# EAGLE design AUX power board (V4.0) (EAGLE 8.4.1)
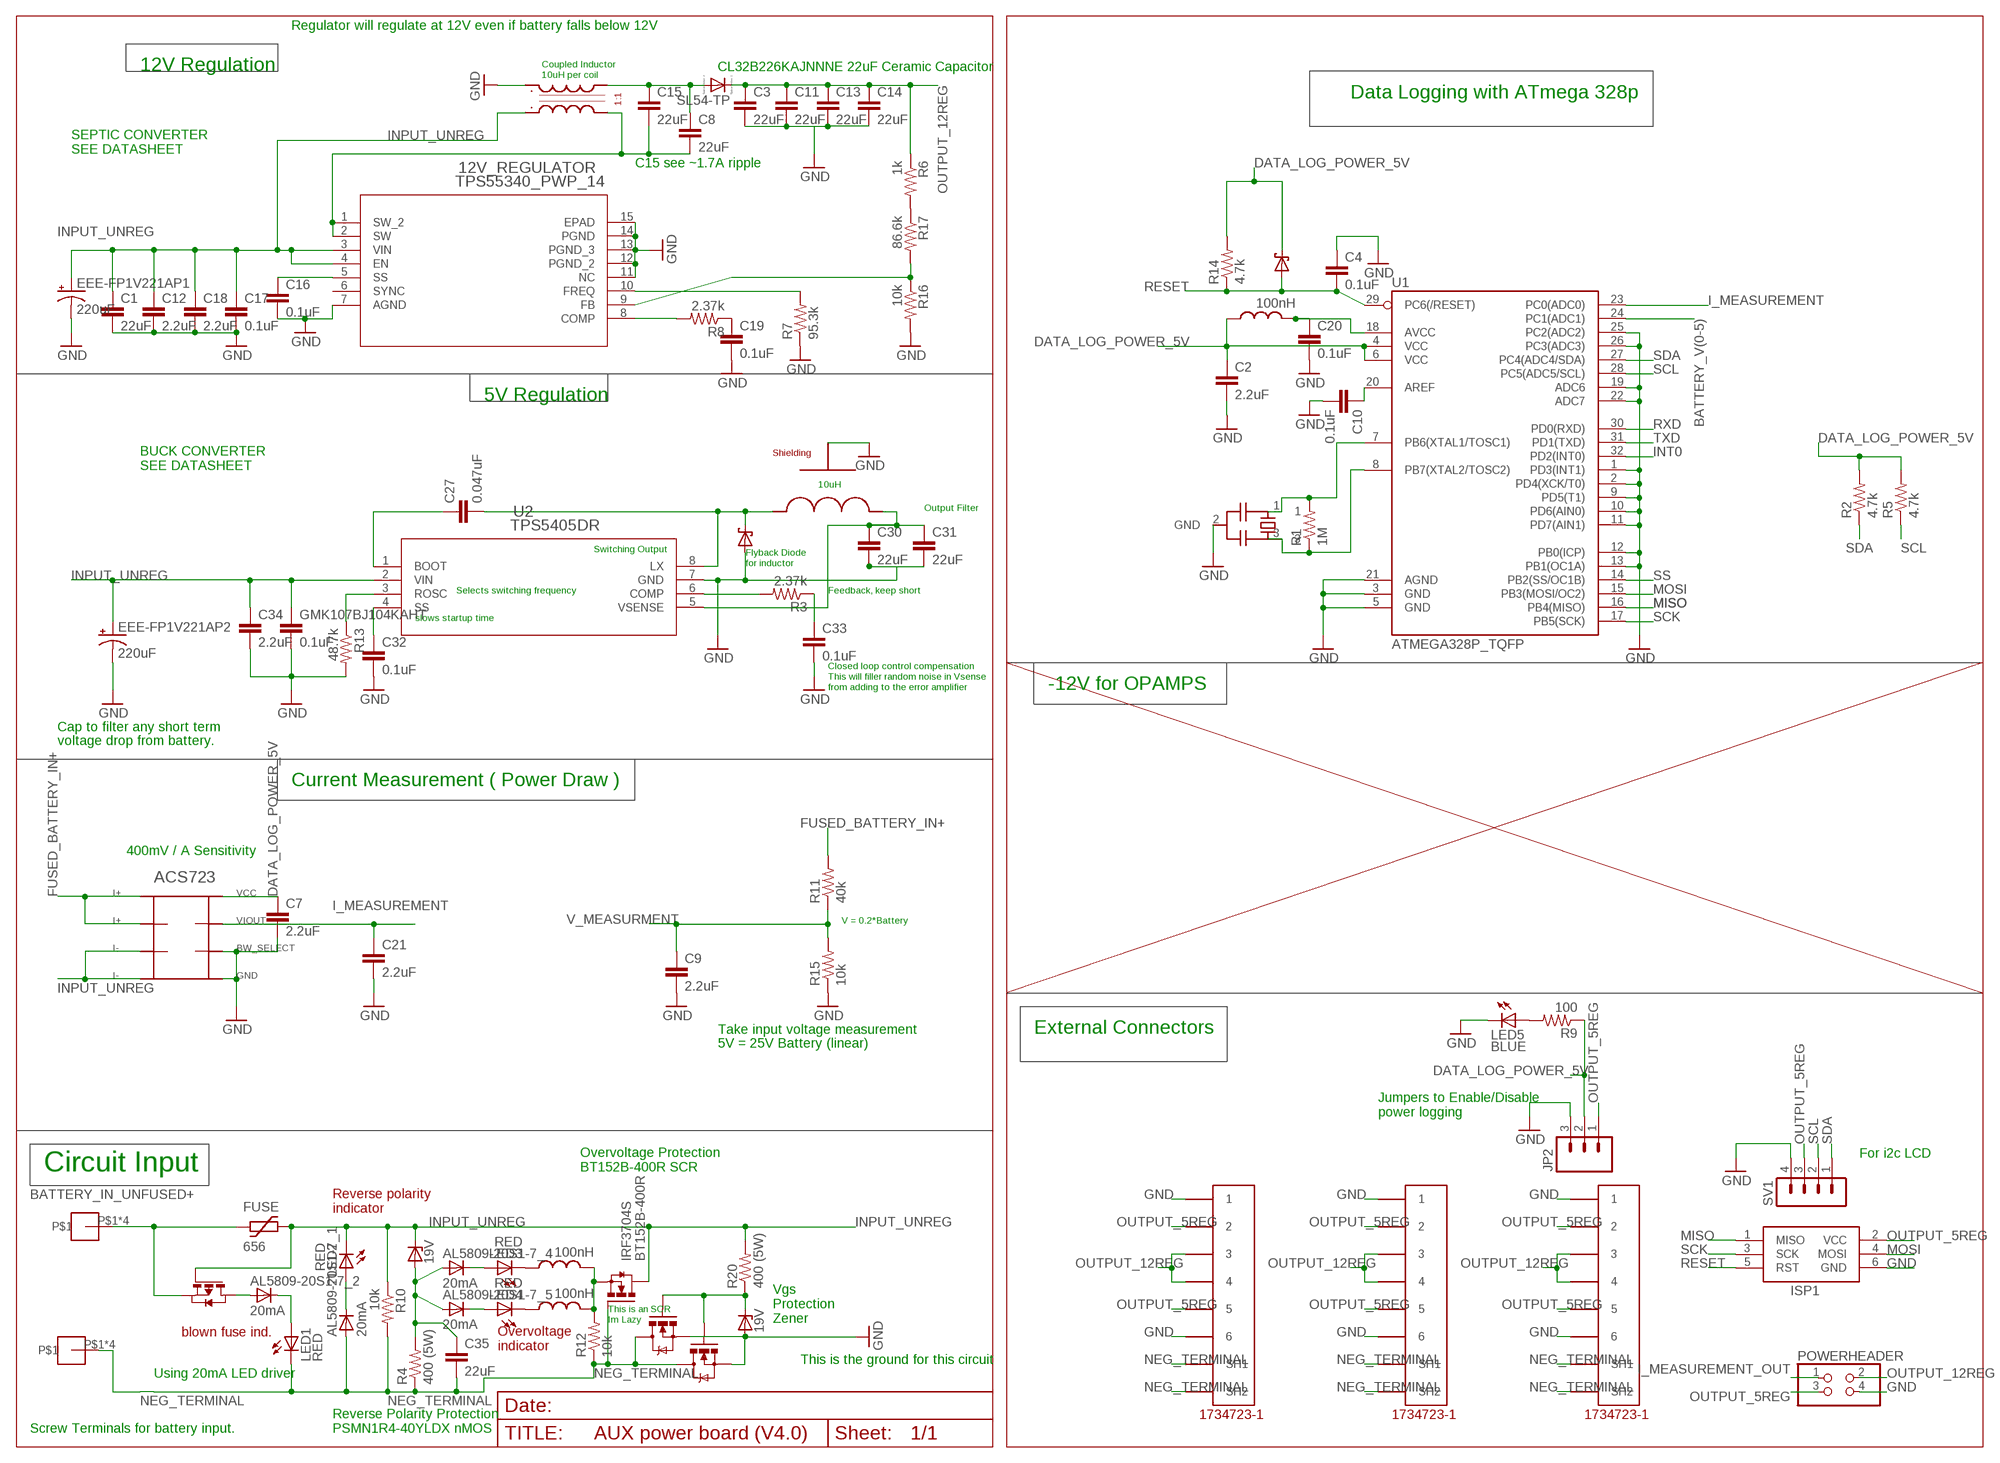
[diagram p0: schematic, sheet 1]

## Parts
1N5354BRLG  19V  ZENER-DIODEDO41Z10  [DO41Z10]
1N5356BRLG_1  19V  ZENER-DIODEDO41Z10  [DO41Z10]
12V_REGULATOR  TPS55340_PWP_14  [PWP14]
16MHZ  CSTCE16M0V53-R0  [RESONATOR]
AL5809-20S1-7_1  20mA  D-SOD123  [SOD123]
AL5809-20S1-7_2  20mA  D-SOD123  [SOD123]
AL5809-20S1-7_4  20mA  D-SOD123  [SOD123]
AL5809-20S1-7_5  20mA  D-SOD123  [SOD123]
BT152B-400R  IRF3704S  [D2PACK]
C1  22uF  C-EUC1210  [C1210]
C2  2.2uF  C-EUC0603  [C0603]
C3  22uF  C-EUC1210  [C1210]
C4  0.1uF  C-EUC0603  [C0603]
C7  2.2uF  C-EUC0603  [C0603]
C8  22uF  C-EUC1210  [C1210]
C9  2.2uF  C-EUC0603  [C0603]
C10  0.1uF  C-EUC0603  [C0603]
C11  22uF  C-EUC1210  [C1210]
C12  2.2uF  C-EUC0603  [C0603]
C13  22uF  C-EUC1210  [C1210]
C14  22uF  C-EUC1210  [C1210]
C15  22uF  C-EUC1210  [C1210]
C16  0.1uF  C-EUC0603  [C0603]
C17  0.1uF  C-EUC0603  [C0603]
C18  2.2uF  C-EUC0603  [C0603]
C19  0.1uF  C-EUC0603  [C0603]
C20  0.1uF  C-EUC0603  [C0603]
C21  2.2uF  C-EUC0603  [C0603]
C27  0.047uF  C-EUC0603  [C0603]
C30  22uF  C-EUC1210  [C1210]
C31  22uF  C-EUC1210  [C1210]
C32  0.1uF  C-EUC0603  [C0603]
C33  0.1uF  C-EUC0603  [C0603]
C34  2.2uF  C-EUC0603  [C0603]
C35  22uF  C-EUC1210  [C1210]
EEE-FP1V221AP1  220uF  CPOL-US175TMP-0808  [175TMP-0808]
EEE-FP1V221AP2  220uF  CPOL-US175TMP-0808  [175TMP-0808]
FUSE  656  [656]
GMK107BJ104KAHT  0.1uF  C-EUC0603  [C0603]
ISP1  AVRISP-6  [AVRISP]
JP2  M03PTH  [1X03]
LED1  RED  LEDSML1206  [SML1206]
LED2  RED  LEDSML1206  [SML1206]
LED3  RED  LEDSML1206  [SML1206]
LED4  RED  LEDSML1206  [SML1206]
LED5  BLUE  LEDSML1206  [SML1206]
MLZ2012DR10DT000  100nH  L-USL2012C  [L2012C]
MLZ2012DR10DT001  100nH  L-USL2012C  [L2012C]
MLZ2012DR10DT002  100nH  L-USL2012C  [L2012C]
MURS120T3G  MBRS130LT3  [SMB]
MURS120T3G1  MBRS130LT3  [SMB]
POWERHEADER  PINHD-2X2  [2X02]
PSMN1R4-40YLDX1  MOSFET-NCHANNELFDS6630A  [POWERSO08]
PSMN1R4-40YLDX2  MOSFET-NCHANNELFDS6630A  [POWERSO08]
R1  1M  R-US_R0603  [R0603]
R2  4.7k  R-US_R0805  [R0805]
R3  2.37k  R-US_R0603  [R0603]
R4  400 (5W)  R-US_0817/22  [P0817/22]
R5  4.7k  R-US_R0805  [R0805]
R6  1k  R-US_R0805  [R0805]
R7  95.3k  R-US_R0603  [R0603]
R8  2.37k  R-US_R0603  [R0603]
R9  100  R-US_R0805  [R0805]
R10  10k  R-US_R0805  [R0805]
R11  40k  R-US_R0805  [R0805]
R12  10k  R-US_R0805  [R0805]
R13  48.7k  R-US_R0805  [R0805]
R14  4.7k  R-US_R0805  [R0805]
R15  10k  R-US_R0805  [R0805]
R16  10k  R-US_R0805  [R0805]
R17  86.6k  R-US_R0805  [R0805]
R20  400 (5W)  R-US_0817/22  [P0817/22]
SL54-TP  DIODE_E-SMC  [DIODE_SMC]
SV1  MA04-1  [MA04-1]
U1  ATMEGA328P_TQFP  [TQFP32-08]
U2  TPS5405DR  [D8]
U$1  ACS723  [SO08]
U$3  5555140-6  [1734723-1_RJ11]
U$4  5555140-6  [1734723-1_RJ11]
U$5  CDEP147NP-100MC-125  [NONSTANDARD]
U$6  SCREW-8191  [SCREW-8191]
U$7  SCREW-8191  [SCREW-8191]
U$9  744873100  [1592]
U$10  5555140-6  [1734723-1_RJ11]
ZVP4525E6TA_1  MOSFET-PCHANNELFDS6675  PMOSSOT23-6  [SOT23-6]

## Nets
BATTERY_IN_UNFUSED+: FUSE.P$1 U$6.P$1 U$6.P$2 U$6.P$3 U$6.P$4 ZVP4525E6TA_1.4(S)
BATTERY_V(0-5): U1.24(PC1(ADC1))
DATA_LOG_POWER_5V: C2.1 C7.1 JP2.2 MLZ2012DR10DT000.1 MURS120T3G1.C R2.2 R5.2 R9.1 R14.2 U1.4(VCC) U1.6(VCC) U$1.8
FUSED_BATTERY_IN+: R11.2 U$1.1 U$1.2
GND: 1N5356BRLG_1.A 12V_REGULATOR.7(AGND) 12V_REGULATOR.11(NC) 12V_REGULATOR.12(PGND_2) 12V_REGULATOR.13(PGND_3) 12V_REGULATOR.14(PGND) 12V_REGULATOR.15(EPAD) 16MHZ.2(GND) C1.2 C2.2 C3.2 C4.1 C7.2 C9.2 C10.2 C11.2 C12.2 C13.2 C14.2 C16.2 C17.2 C18.2 C19.2 C20.2 C21.2 C30.2 C31.2 C32.2 C33.2 C34.2 EEE-FP1V221AP1.- EEE-FP1V221AP2.- GMK107BJ104KAHT.2 ISP1.6(GND) JP2.3 LED5.C MURS120T3G.A POWERHEADER.4 PSMN1R4-40YLDX1.SOURCE1(S) PSMN1R4-40YLDX1.SOURCE2(S) PSMN1R4-40YLDX1.SOURCE(S) PSMN1R4-40YLDX2.SOURCE1(S) PSMN1R4-40YLDX2.SOURCE2(S) PSMN1R4-40YLDX2.SOURCE(S) R7.1 R13.2 R15.1 R16.2 SV1.4 U1.1(PD3(INT1)) U1.2(PD4(XCK/T0)) U1.3(GND) U1.5(GND) U1.9(PD5(T1)) U1.10(PD6(AIN0)) U1.11(PD7(AIN1)) U1.12(PB0(ICP)) U1.13(PB1(OC1A)) U1.19(ADC6) U1.21(AGND) U1.22(ADC7) U1.25(PC2(ADC2)) U1.26(PC3(ADC3)) U2.7(GND) U$1.5 U$1.6 U$3.6 U$4.6 U$5.GND U$9.L1_P1(L1_A) U$10.6
I_MEASUREMENT: C21.1 U1.23(PC0(ADC0)) U$1.7
I_MEASUREMENT_OUT: POWERHEADER.1
INPUT_UNREG: 1N5354BRLG.C 12V_REGULATOR.3(VIN) 12V_REGULATOR.4(EN) BT152B-400R.2(D) C1.1 C12.1 C17.1 C18.1 C34.1 EEE-FP1V221AP1.+ EEE-FP1V221AP2.+ FUSE.P$2 GMK107BJ104KAHT.1 LED2.C R10.1 R20.2 U2.2(VIN) U$1.3 U$1.4 U$9.L2_P2(L2_A) ZVP4525E6TA_1.3(G)
INT0: U1.32(PD2(INT0))
MISO: ISP1.1(MISO) U1.16(PB4(MISO))
MOSI: ISP1.4(MOSI) U1.15(PB3(MOSI/OC2))
N$1: C27.1 U2.1(BOOT)
N$3: R6.2 R17.1
N$4: 12V_REGULATOR.1(SW_2) 12V_REGULATOR.2(SW) C8.2 C15.2 U$9.L2_P3(L2_B)
N$5: C20.1 MLZ2012DR10DT000.2 U1.18(AVCC)
N$6: C8.1 C15.1 SL54-TP.A(C) U$9.L1_P4(L1_B)
N$7: C27.2 MURS120T3G.C U2.8(LX) U$5.PAD1(PIN1)
N$8: 12V_REGULATOR.5(SS) C16.1
N$9: 12V_REGULATOR.8(COMP) R8.2
N$10: 12V_REGULATOR.10(FREQ) R7.2
N$13: C19.1 R8.1
N$14: C10.1 U1.20(AREF)
N$15: 12V_REGULATOR.9(FB) R16.1 R17.2
N$17: AL5809-20S1-7_2.2(A) ZVP4525E6TA_1.1(D) ZVP4525E6TA_1.2(D) ZVP4525E6TA_1.5(D) ZVP4525E6TA_1.6(D)
N$18: 16MHZ.1 R1.2 U1.7(PB6(XTAL1/TOSC1))
N$19: 1N5356BRLG_1.C PSMN1R4-40YLDX1.GATE(G) PSMN1R4-40YLDX2.GATE(G) R20.1
N$20: R13.1 U2.3(ROSC)
N$21: C32.1 U2.4(SS)
N$22: AL5809-20S1-7_1.1(C) LED2.A
N$23: C33.1 R3.1
N$24: R3.2 U2.6(COMP)
N$25: AL5809-20S1-7_2.1(C) LED1.A
N$26: C30.1 C31.1 U2.5(VSENSE) U$5.PAD2(PIN2)
N$27: 16MHZ.3 R1.1 U1.8(PB7(XTAL2/TOSC2))
N$28: AL5809-20S1-7_4.1(C) LED3.A
N$29: 1N5354BRLG.A AL5809-20S1-7_4.2(A) AL5809-20S1-7_5.2(A) C35.1 R4.2
N$30: LED3.C MLZ2012DR10DT001.1
N$31: AL5809-20S1-7_5.1(C) LED4.A
N$32: LED4.C MLZ2012DR10DT002.1
N$33: BT152B-400R.3(S) MLZ2012DR10DT001.2 MLZ2012DR10DT002.2 R12.2
N$34: LED5.A R9.2
NEG_TERMINAL: AL5809-20S1-7_1.2(A) BT152B-400R.1(G) C35.2 LED1.C PSMN1R4-40YLDX1.DRAIN1(D) PSMN1R4-40YLDX1.DRAIN(D) PSMN1R4-40YLDX2.DRAIN1(D) PSMN1R4-40YLDX2.DRAIN(D) R4.1 R10.2 R12.1 U$3.SH1 U$3.SH2 U$4.SH1 U$4.SH2 U$7.P$1 U$7.P$2 U$7.P$3 U$7.P$4 U$10.SH1 U$10.SH2
OUTPUT_5REG: ISP1.2(VCC) JP2.1 POWERHEADER.3 SV1.3 U$3.2 U$3.5 U$4.2 U$4.5 U$10.2 U$10.5
OUTPUT_12REG: C3.1 C11.1 C13.1 C14.1 POWERHEADER.2 R6.1 SL54-TP.C(A) U$3.3 U$3.4 U$4.3 U$4.4 U$10.3 U$10.4
RESET: C4.2 ISP1.5(RST) MURS120T3G1.A R14.1 U1.29(PC6(/RESET))
RXD: U1.30(PD0(RXD))
SCK: ISP1.3(SCK) U1.17(PB5(SCK))
SCL: R5.1 SV1.2 U1.28(PC5(ADC5/SCL))
SDA: R2.1 SV1.1 U1.27(PC4(ADC4/SDA))
SS: U1.14(PB2(SS/OC1B))
TXD: U1.31(PD1(TXD))
V_MEASURMENT: C9.1 R11.1 R15.2
Unconnected: 12V_REGULATOR.6(SYNC) U$3.1 U$4.1 U$10.1

## Notes on the sheet
- Regulator will regulate at 12V even if battery falls below 12V
- 12V Regulation | CL32B226KAJNNNE 22uF Ceramic Capacitor
- Coupled Inductor
  10uH per coil
- Data Logging with ATmega 328p
- SEPTIC CONVERTER
  SEE DATASHEET
- C15 see ~1.7A ripple
- 5V Regulation
- BUCK CONVERTER
  SEE DATASHEET
- 10uH
- Output Filter
- Switching Output
- Flyback Diode
  for inductor
- Selects switching frequency | Feedback, keep short
- slows startup time
- Closed loop control compensation
  This will filler random noise in Vsense
  from adding to the error amplifier
- -12V for OPAMPS
- Cap to filter any short term
- voltage drop from battery.
- Current Measurement ( Power Draw )
- 400mV / A Sensitivity
- V = 0.2*Battery
- Take input voltage measurement | External Connectors
- 5V = 25V Battery (linear)
- Jumpers to Enable/Disable
  power logging
- For i2c LCD
- Circuit Input
- Overvoltage Protection
  BT152B-400R SCR
- Reverse polarity
  indicator
- This is an SCR
  Im Lazy
- Vgs 
  Protection
  Zener
- blown fuse ind.
- Overvoltage
  indicator
- This is the ground for this circuit
- Using 20mA LED driver
- Screw Terminals for battery input.
- Reverse Polarity Protection
  PSMN1R4-40YLDX nMOS

## Library data of the parts
1N5354BRLG 1N5356BRLG_1 = diode:ZENER-DIODE: Z-Diode
12V_REGULATOR = TPS55340PWP:TPS55340_PWP_14; MANUFACTURER_PART_NUMBER: tps55340_pwp_14; VENDOR: Texas Instruments
16MHZ = arduino_Uno_Rev3-02-TH:CSTCE16M0V53-R0
AL5809-20S1-7_1 AL5809-20S1-7_2 AL5809-20S1-7_4 AL5809-20S1-7_5 = semicon-smd-ipc:D-: DIODE unfilled
BT152B-400R = transistor-power:IRF3704: SMPS MOSFET HEXFET® Power MOSFET Source: http://www.irf.com/product-info/datasheets/data/irf3704.pdf
C1 C3 C4 C7-C9 C11-C21 C27 C30-C35 GMK107BJ104KAHT = rcl:C-EU: CAPACITOR, European symbol
C2 C10 = resistor:C-EU: CAPACITOR, European symbol
EEE-FP1V221AP1 EEE-FP1V221AP2 = rcl:CPOL-US: POLARIZED CAPACITOR, American symbol
FUSE = GlassFuseHolder:656
ISP1 = adafruit:AVRISP: AVR ISP HEADER Standard 6 pin header for AVR programming
JP2 = SparkFun (2015_10_14 22_27_04 UTC):M03: Header 3 Standard 3-pin 0.1" header. Use with straight break away headers (SKU : PRT-00116), right angle break away headers (PRT-00553), swiss pins (PRT-00743), machine pins (PRT-00117), and female headers (PRT-00115). Molex polarized connector foot print use with SKU : PRT-08232 with associated crimp pins and housings.
LED1-LED5 = E-P-008-R1.2:LED: LED OSRAM: - CHIPLED LG R971, LG N971, LY N971, LG Q971, LY Q971, LO R971, LY R971 LH N974, LH R974 LS Q976, LO Q976, LY Q976 LO Q996 - Hyper CHIPLED LW Q18S LB Q993, LB Q99A, LB R99A - SideLED LS A670, LO A670, LY A670, LG A670, LP A670 LB A673, LV A673, LT A673, LW A673 LH A674 LY A675 LS A676, LA A676, LO A676, LY A676, LW A676 LS A679, LY A679, LG A679 - Hyper Micro SIDELED® LS Y876, LA Y876, LO Y876, LY Y876 LT Y87S - SmartLED LW L88C, LW L88S LB L89C, LB L89S, LG L890 LS L89K, LO L89K, LY L89K LS L896, LA L896, LO L896, LY L896 - TOPLED LS T670, LO T670, LY T670, LG T670, LP T670 LSG T670, LSP T670, LSY T670, LOP T670, LYG T670 LG T671, LOG T671, LSG T671 LB T673, LV T673, LT T673, LW T673 LH T674 LS T676, LA T676, LO T676, LY T676, LB T676, LH T676, LSB T676, LW T676 LB T67C, LV T67C, LT T67C, LS T67K, LO T67K, LY T67K, LW E67C LS E67B, LA E67B, LO E67B, LY E67B, LB E67C, LV E67C, LT E67C LW T67C LS T679, LY T679, LG T679 LS T770, LO T770, LY T770, LG T770, LP T770 LB T773, LV T773, LT T773, LW T773 LH T774 LS E675, LA E675, LY E675, LS T675 LS T776, LA T776, LO T776, LY T776, LB T776 LHGB T686 LT T68C, LB T68C - Hyper Mini TOPLED® LB M676 - Mini TOPLED Santana® LG M470 LS M47K, LO M47K, LY M47K Source: http://www.osram.convergy.de LUXEON: - LUMILED® LXK2-PW12-R00, LXK2-PW12-S00, LXK2-PW14-U00, LXK2-PW14-V00 LXK2-PM12-R00, LXK2-PM12-S00, LXK2-PM14-U00 LXK2-PE12-Q00, LXK2-PE12-R00, LXK2-PE12-S00, LXK2-PE14-T00, LXK2-PE14-U00 LXK2-PB12-K00, LXK2-PB12-L00, LXK2-PB12-M00, LXK2-PB14-N00, LXK2-PB14-P00, LXK2-PB14-Q00 LXK2-PR12-L00, LXK2-PR12-M00, LXK2-PR14-Q00, LXK2-PR14-R00 LXK2-PD12-Q00, LXK2-PD12-R00, LXK2-PD12-S00 LXK2-PH12-R00, LXK2-PH12-S00 LXK2-PL12-P00, LXK2-PL12-Q00, LXK2-PL12-R00 Source: www.luxeon.com KINGBRIGHT: KA-3528ASYC Source: www.kingbright.com
MLZ2012DR10DT000 MLZ2012DR10DT001 MLZ2012DR10DT002 = resistor:L-US: INDUCTOR, American symbol
MURS120T3G MURS120T3G1 = diode:MBRS130LT3: Schottky Power Rectifier Source: http://www.onsemi.com/pub/Collateral/MBRS130LT3-D.PDF
POWERHEADER = pinhead:PINHD-2X2: PIN HEADER
PSMN1R4-40YLDX1 PSMN1R4-40YLDX2 = PSMN1R4-40YLDX:MOSFET-NCHANNEL: Common NMOSFET Parts MFG P/N Store ID Prod ID FDD8780 TRANS-09984 SI7820DN TRANS-11055 FDS6630A IC-08089 2N7002PW TRANS-11151 FQP30N06L COM-10213 TRANS-10060 BSS123LT1G TRANS-08345 BSS138 TRANS-00830 BS170 2N7000; PROD_ID: IC-08089
R1 R2 R5 R9-R12 R14 R15 = rcl:R-US_: RESISTOR, American symbol
R3 R6-R8 R13 R16 R17 = resistor:R-US_: RESISTOR, American symbol
R4 R20 = resistor@1:R-US_: RESISTOR, American symbol
SL54-TP = eagle-ltspice:DIODE_E-: Schottky Diode; SPICEMODEL: diode; SPICEPREFIX: D
SV1 = con-lstb:MA04-1: PIN HEADER; OC_FARNELL: unknown; OC_NEWARK: unknown
U1 = SparkFun-DigitalIC:ATMEGA328P_TQFP; PROD_ID: IC-09069
U2 = TPS5405DR:TPS5405DR; MANUFACTURER_PART_NUMBER: tps5405dr; VENDOR: TEXAS INSTRUMENTS
U$1 = linear:ACS723
U$3 U$4 U$10 = 5555140-6 RJ11:5555140-6
U$5 = CDEP147NP-100MC-125:CDEP147NP-100MC-125
U$6 U$7 = Shell2013:SCREW-8191
U$9 = 744873100:744873100
ZVP4525E6TA_1 = zetex:PMOSSOT23-6: P-CHANNEL ENHANCEMENT MODE MOSFET Source: Data sheet <http://www.diodes.com/zetex/_pdfs/3.0/pdf/ZXMP10A17E6.pdf> ZXMP10A17E6; OC_FARNELL: unknown; OC_NEWARK: unknown

## Board
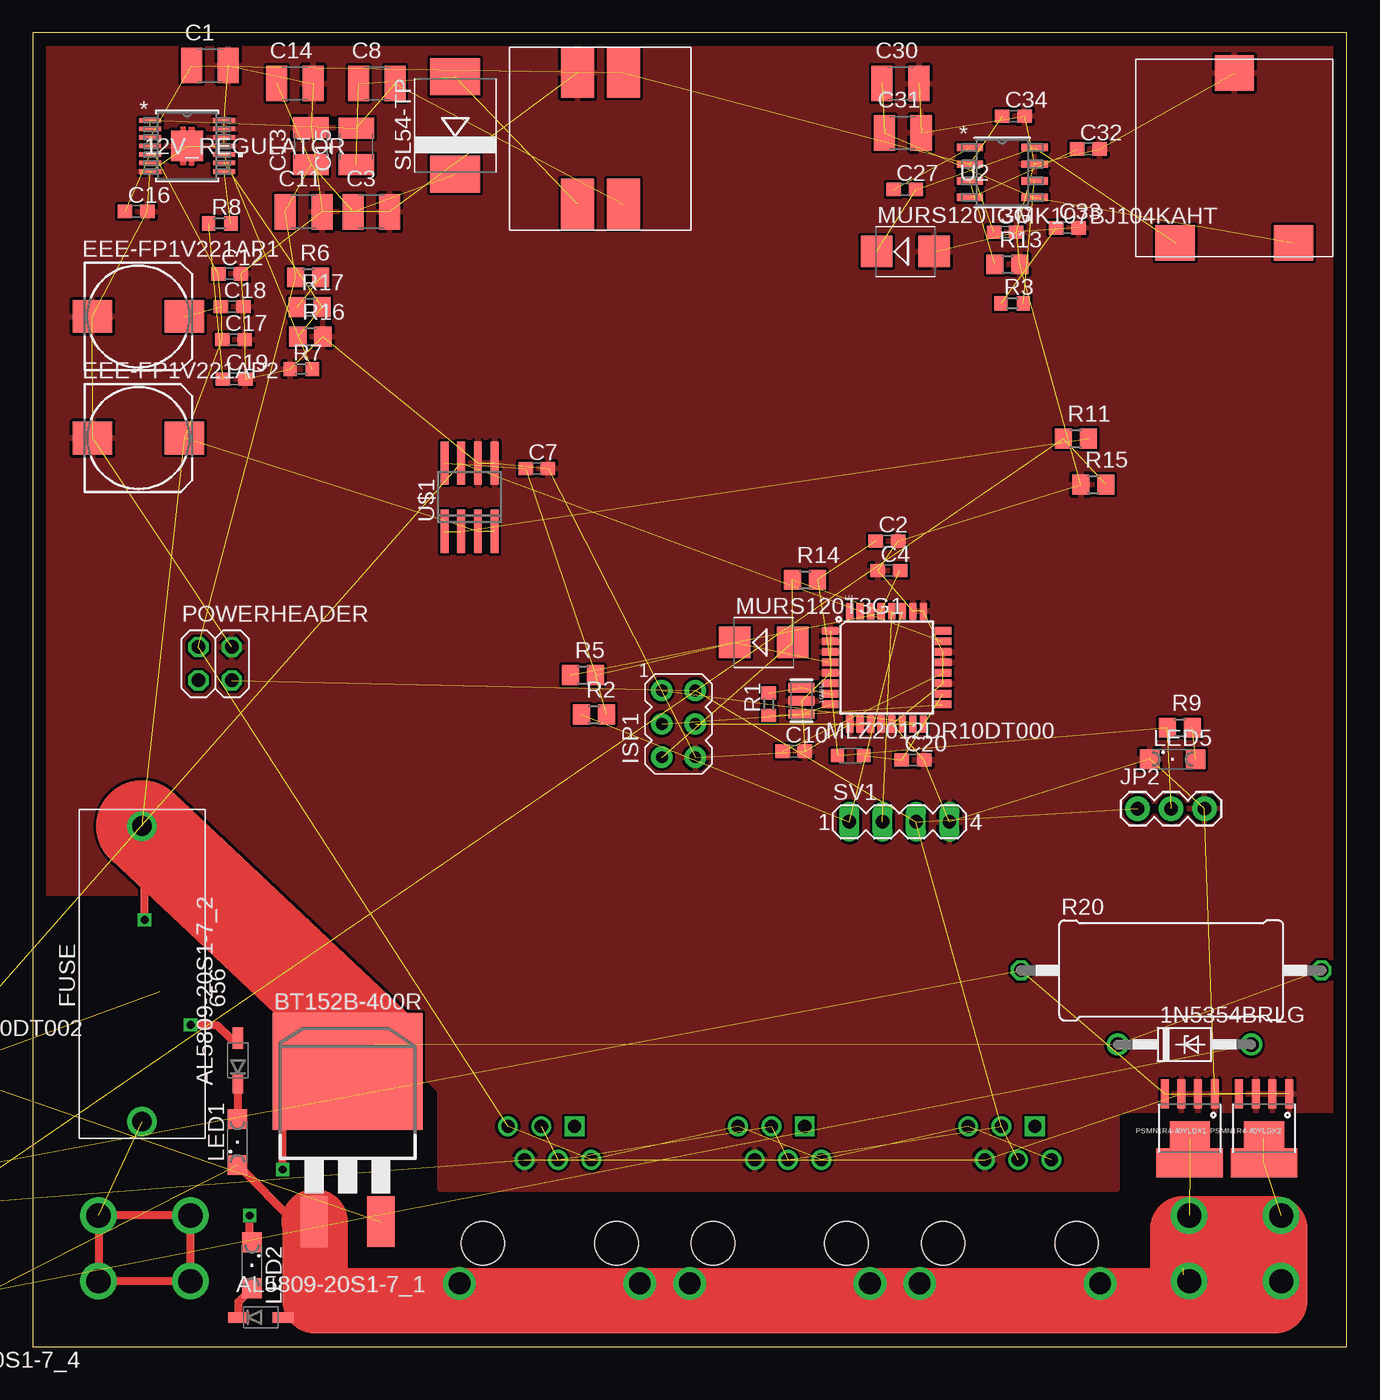
[diagram p1: board, top side]
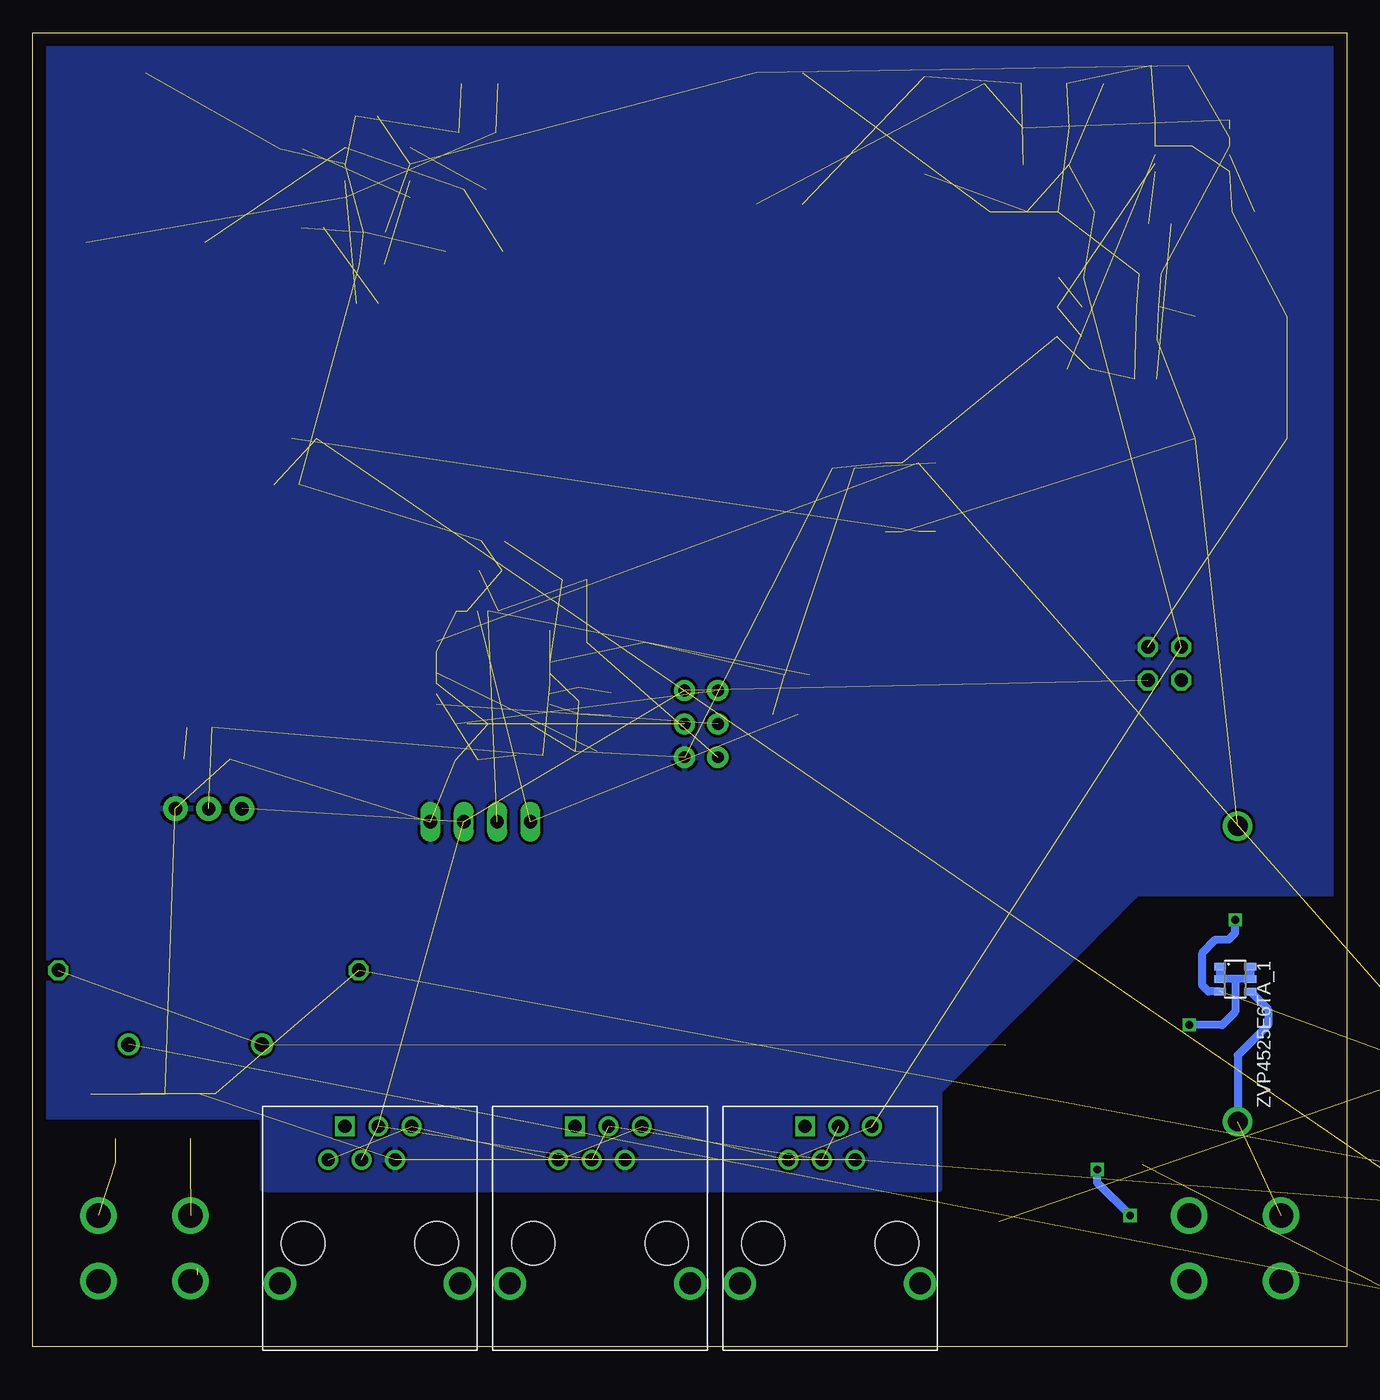
[diagram p2: board, bottom side, seen from below]

Size 100 x 100 mm. Coordinates in mm from the lower left corner, seen from the top.
Outline: 0,0 100,0 100,100 0,100 0,0
Copper layers (1*16): Top 0.035mm / dielectric 1.5mm / Bottom 0.035mm
Design rules "default": minimum track width 10mil, minimum drill 24mil, track to track 8mil, track to pad 8mil, pad to pad 8mil, via to via 8mil, smd to smd 8mil, copper to edge 40mil, drill to drill 8mil, minimum pad ring 10mil, minimum via ring 8mil, stop-mask expansion 4mil, vias tented up to drill 0mil, thermal gap 10mil

### Footprints (pad centres in the part's own frame; a part is rotated, then mirrored left to right if it is on the bottom)
DO41Z10 = drill 1.118: A 5.08,0; C -5.08,0
PWP14 = smd 1.676 x 0.356: 1 -2.819,1.95; 2 -2.819,1.3; 3 -2.819,0.65; 4 -2.819,0; 5 -2.819,-0.65; 6 -2.819,-1.3; 7 -2.819,-1.95; 8 2.819,-1.95; 9 2.819,-1.3; 10 2.819,-0.65; 11 2.819,0; 12 2.819,0.65; 13 2.819,1.3; 14 2.819,1.95 | smd 2.46 x 2.31: 15 0,0
RESONATOR = smd 0.7 x 2: 1 -1,0; 2 0,0; 3 1,0
SOD123 = smd 1.6 x 0.8: 1 -1.7,0; 2 1.7,0
D2PACK = smd 2.083 x 3.81: 1 -2.54,-8.89; 3 2.54,-8.89 | smd 11.43 x 8.89: 2 0,2.54
C1210 = smd 1.6 x 2.7: 1 -1.4,0; 2 1.4,0
C0603 = smd 1.1 x 1: 1 -0.85,0; 2 0.85,0
175TMP-0808 = smd 3 x 2.5: + 3.5,0; - -3.5,0
656 = drill 1.5: P$1 -11.25,0; P$2 11.25,0
AVRISP = drill 0.9 pad 1.626: 1 -1.27,2.54; 2 1.27,2.54; 3 -1.27,0; 4 1.27,0; 5 -1.27,-2.54; 6 1.27,-2.54
1X03 = drill 1.016 pad 1.88: 1 0,0; 2 2.54,0; 3 5.08,0
SML1206 = smd 1.5 x 1.5: A 1.75,0; C -1.75,0
L2012C = smd 1 x 1: 1 -1,0; 2 1,0
SMB = smd 2.4 x 2.4: A 2.2,0; C -2.2,0
2X02 = drill 1.016 octagon: 1 -1.27,-1.27; 2 -1.27,1.27; 3 1.27,-1.27; 4 1.27,1.27
POWERSO08 = smd 3.048 x 2.54: DRAIN 0,0.762 | smd 5.08 x 2.21: DRAIN1 0,2.616 | smd 0.61 x 2.21: GATE 1.905,-2.616; SOURCE -1.905,-2.616; SOURCE1 -0.635,-2.616; SOURCE2 0.635,-2.616
R0603 = smd 1 x 1.1: 1 -0.85,0; 2 0.85,0
R0805 = smd 1.3 x 1.5: 1 -0.95,0; 2 0.95,0
P0817/22 = drill 1.016 octagon: 1 -11.43,0; 2 11.43,0
DIODE_SMC = smd 2.8 x 3.8: A 3.7,0; C -3.7,0
MA04-1 = drill 1.016 long: 1 -3.81,0; 2 -1.27,0; 3 1.27,0; 4 3.81,0
TQFP32-08 = smd 1.27 x 0.559: 1 -4.293,2.8; 2 -4.293,2; 3 -4.293,1.2; 4 -4.293,0.4; 5 -4.293,-0.4; 6 -4.293,-1.2; 7 -4.293,-2; 8 -4.293,-2.8; 17 4.293,-2.8; 18 4.293,-2; 19 4.293,-1.2; 20 4.293,-0.4; 21 4.293,0.4; 22 4.293,1.2; 23 4.293,2; 24 4.293,2.8 | smd 0.559 x 1.27: 9 -2.8,-4.293; 10 -2,-4.293; 11 -1.2,-4.293; 12 -0.4,-4.293; 13 0.4,-4.293; 14 1.2,-4.293; 15 2,-4.293; 16 2.8,-4.293; 25 2.8,4.293; 26 2,4.293; 27 1.2,4.293; 28 0.4,4.293; 29 -0.4,4.293; 30 -1.2,4.293; 31 -2,4.293; 32 -2.8,4.293
D8 = smd 1.981 x 0.559: 1 -2.464,1.905; 2 -2.464,0.635; 3 -2.464,-0.635; 4 -2.464,-1.905; 5 2.464,-1.905; 6 2.464,-0.635; 7 2.464,0.635; 8 2.464,1.905
SO08 = smd 0.6 x 3.302: 1 -1.905,-2.6; 2 -0.635,-2.6; 3 0.635,-2.6; 4 1.905,-2.6; 5 1.905,2.6; 6 0.635,2.6; 7 -0.635,2.6; 8 -1.905,2.6
1734723-1_RJ11 = drill 1 square: 1 1.27,5.08 | drill 1: 2 -1.27,5.08; 3 -3.81,5.08; 4 2.54,2.54; 5 0,2.54; 6 -2.54,2.54 | drill 1.65: SH1 6.23,-6.86; SH2 -7.49,-6.86 | hole 3.3: 4.45,-3.81; -5.71,-3.81
NONSTANDARD = smd 3 x 2.7: GND 0,11.55; PAD1 -4.5,-1.35; PAD2 4.5,-1.35
SCREW-8191 = drill 1.85: P$1 0,0; P$2 0,5; P$3 7,5; P$4 7,0
1592 = smd 2.5 x 3.85: L1_P1 -1.25,8.07; L1_P4 -1.25,-1.93; L2_P2 2.25,8.07; L2_P3 2.25,-1.93
SOT23-6 = smd 0.6 x 0.9: 1 -0.95,-1.15; 2 0,-1.15; 3 0.95,-1.15; 4 0.95,1.15; 5 0,1.15; 6 -0.95,1.15

### Placement (x,y rotation side)
1N5354BRLG  87.64,23.01 0 top
1N5356BRLG_1  -17.22,10.39 0 top  (outside the outline)
12V_REGULATOR  11.75,91.39 0 top
16MHZ  58.49,49.17 270 top
AL5809-20S1-7_1  17.36,2.25 0 top
AL5809-20S1-7_2  15.6,21.8 90 top
AL5809-20S1-7_4  -8.91,-3.5 0 top  (outside the outline)
AL5809-20S1-7_5  -26.67,-8.75 0 top  (outside the outline)
BT152B-400R  23.95,18.43 0 top
C1  13.48,97.5 0 top
C2  65,61.33 0 top
C3  25.76,86.39 0 top
C4  65.15,59.08 0 top
C7  38.35,66.83 0 top
C8  26.18,96.14 0 top
C9  -43.5,-15 0 top  (outside the outline)
C10  57.9,45.33 0 top
C11  20.6,86.39 0 top
C12  14.97,81.66 0 top
C13  21.16,91.37 90 top
C14  19.94,96.14 0 top
C15  24.61,91.36 90 top
C16  7.87,86.41 0 top
C17  15.27,76.66 0 top
C18  15.17,79.16 0 top
C19  15.32,73.66 0 top
C20  66.97,44.66 0 top
C21  -43.5,-20 0 top  (outside the outline)
C27  66.35,88.08 0 top
C30  66.03,96.14 0 top
C31  66.2,92.39 0 top
C32  80.32,91.16 0 top
C33  78.72,85.16 0 top
C34  74.62,93.66 0 top
C35  -6.38,3.39 0 top  (outside the outline)
EEE-FP1V221AP1  8.03,78.42 0 top
EEE-FP1V221AP2  8.04,69.17 0 top
FUSE  8.31,28.39 90 top
GMK107BJ104KAHT  73.99,84.83 0 top
ISP1  49.14,47.41 0 top
JP2  84.08,40.96 0 top
LED1  15.57,15.59 90 top
LED2  16.68,6.21 270 top
LED3  -18.56,17.73 0 top  (outside the outline)
LED4  -24.66,37.98 0 top  (outside the outline)
LED5  86.74,44.73 0 top
MLZ2012DR10DT000  62.23,45.01 0 top
MLZ2012DR10DT001  -20.82,24.26 0 top  (outside the outline)
MLZ2012DR10DT002  -11.71,22.38 0 top  (outside the outline)
MURS120T3G  66.4,83.36 0 top
MURS120T3G1  55.62,53.61 0 top
POWERHEADER  13.87,52 0 top
PSMN1R4-40YLDX1  88.03,16.64 180 top
PSMN1R4-40YLDX2  93.69,16.64 180 top
R1  56.01,48.91 90 top
R2  42.72,48.13 0 top
R3  74.52,79.41 0 top
R4  -27.22,2.66 0 top  (outside the outline)
R5  41.87,51.13 0 top
R6  20.96,81.38 0 top
R7  20.42,74.41 0 top
R8  14.22,85.49 0 top
R9  87.29,47.13 0 top
R10  -29.56,12.38 0 top  (outside the outline)
R11  79.36,69.13 0 top
R12  -30.38,29.53 90 top  (outside the outline)
R13  74.17,82.38 0 top
R14  58.77,58.38 0 top
R15  80.7,65.63 0 top
R16  21.12,76.88 0 top
R17  21.07,79.13 0 top
R20  86.63,28.66 0 top
SL54-TP  32.14,92.95 90 top
SV1  65.94,39.96 0 top
U1  64.97,51.7 0 top
U2  73.77,89.37 0 top
U$1  33.23,64.66 0 top
U$3  74.98,11.7 0 top
U$4  57.47,11.7 0 top
U$5  91.43,85.38 0 top
U$6  5,5 0 top
U$7  88,5 0 top
U$9  42.69,88.9 0 top
U$10  39.96,11.7 0 top
ZVP4525E6TA_1  8.51,27.99 270 bottom

### Tracks (layer width: path | path; a pad name or v marks a point on that pad's centre or on a via)
BATTERY_IN_UNFUSED+  (1 unrouted)
  Bottom 0.61: ZVP4525E6TA_1.4 6,25.68 6,24.5 8.31,22.19 FUSE.P$1
DATA_LOG_POWER_5V  (11 unrouted)
FUSED_BATTERY_IN+  (2 unrouted)
GND  (70 unrouted)
  pour Top: 101.5,102.5 101.5,18 82.5,18 82.5,12 31,12 31,19.5 16,34.5 -1.5,34.5 -1.5,102.5
  pour Bottom: -2.5,103.5 102,103.5 102,17.5 82.5,17.5 82.5,12 31,12 31,19.5 16,34.5 -1.5,34.5 -1.5,102.5
I_MEASUREMENT  (2 unrouted)
INPUT_UNREG  (via drill 0.6)  (17 unrouted)
  Top 0.61: v8.5,32.5 8.5,39.45 FUSE.P$2 | LED2.C 16.5,8.14 v16.5,10 | v19,13.5 19,20.97 BT152B-400R.2
  Top 7: FUSE.P$2 26,23 BT152B-400R.2
  Bottom 0.61: ZVP4525E6TA_1.3 10.54,27.04 11,27.5 11,30 10,31 9,31 8.5,31.5 v8.5,32.5 | v16.5,10 19,12.5 v19,13.5
MISO  (1 unrouted)
MOSI  (1 unrouted)
N$1  (1 unrouted)
N$3  (1 unrouted)
N$4  (4 unrouted)
N$5  (2 unrouted)
N$6  (3 unrouted)
N$7  (3 unrouted)
N$8  (1 unrouted)
N$9  (1 unrouted)
N$10  (1 unrouted)
N$13  (1 unrouted)
N$14  (1 unrouted)
N$15  (2 unrouted)
N$17  (via drill 0.6)
  Top 0.61: v12,24.5 14,24.5 15,23.5 AL5809-20S1-7_2.2
  Bottom 0.61: ZVP4525E6TA_1.1 ZVP4525E6TA_1.2 ZVP4525E6TA_1.5 | ZVP4525E6TA_1.6 ZVP4525E6TA_1.5 | ZVP4525E6TA_1.5 8.5,28 8.5,25.5 9.5,24.5 v12,24.5
N$18  (2 unrouted)
N$19  (3 unrouted)
N$20  (1 unrouted)
N$21  (1 unrouted)
N$22
  Top 0.61: AL5809-20S1-7_1.1 15.66,3.44 LED2.A
N$23  (1 unrouted)
N$24  (1 unrouted)
N$25
  Top 0.61: AL5809-20S1-7_2.1 15.57,20.07 LED1.A
N$26  (3 unrouted)
N$27  (2 unrouted)
N$28  (1 unrouted)
N$29  (4 unrouted)
N$30  (1 unrouted)
N$31  (1 unrouted)
N$32  (1 unrouted)
N$33  (3 unrouted)
N$34  (1 unrouted)
NEG_TERMINAL  (9 unrouted)
  Top 0.61: LED1.C 19.87,9.54 BT152B-400R.1 | AL5809-20S1-7_1.2 20.25,2.25 21.5,3.5
  Top 1.27: U$4.SH2 U$10.SH1 46.19,4.5 33,4.5 33,4.84 U$10.SH2 32.47,3.5 21.5,3.5 | U$4.SH1 U$3.SH2 U$3.SH1 87.5,4.84 87.5,5.5 88,5.5 U$7.P$1
  Top 5: 91,6.5 90.5,6 87.5,6 87.5,9 94.5,9 94.5,3.5 21.5,3.5 21.5,9.54 BT152B-400R.1
OUTPUT_5REG  (9 unrouted)
OUTPUT_12REG  (12 unrouted)
RESET  (4 unrouted)
SCK  (1 unrouted)
SCL  (2 unrouted)
SDA  (2 unrouted)
V_MEASURMENT  (2 unrouted)